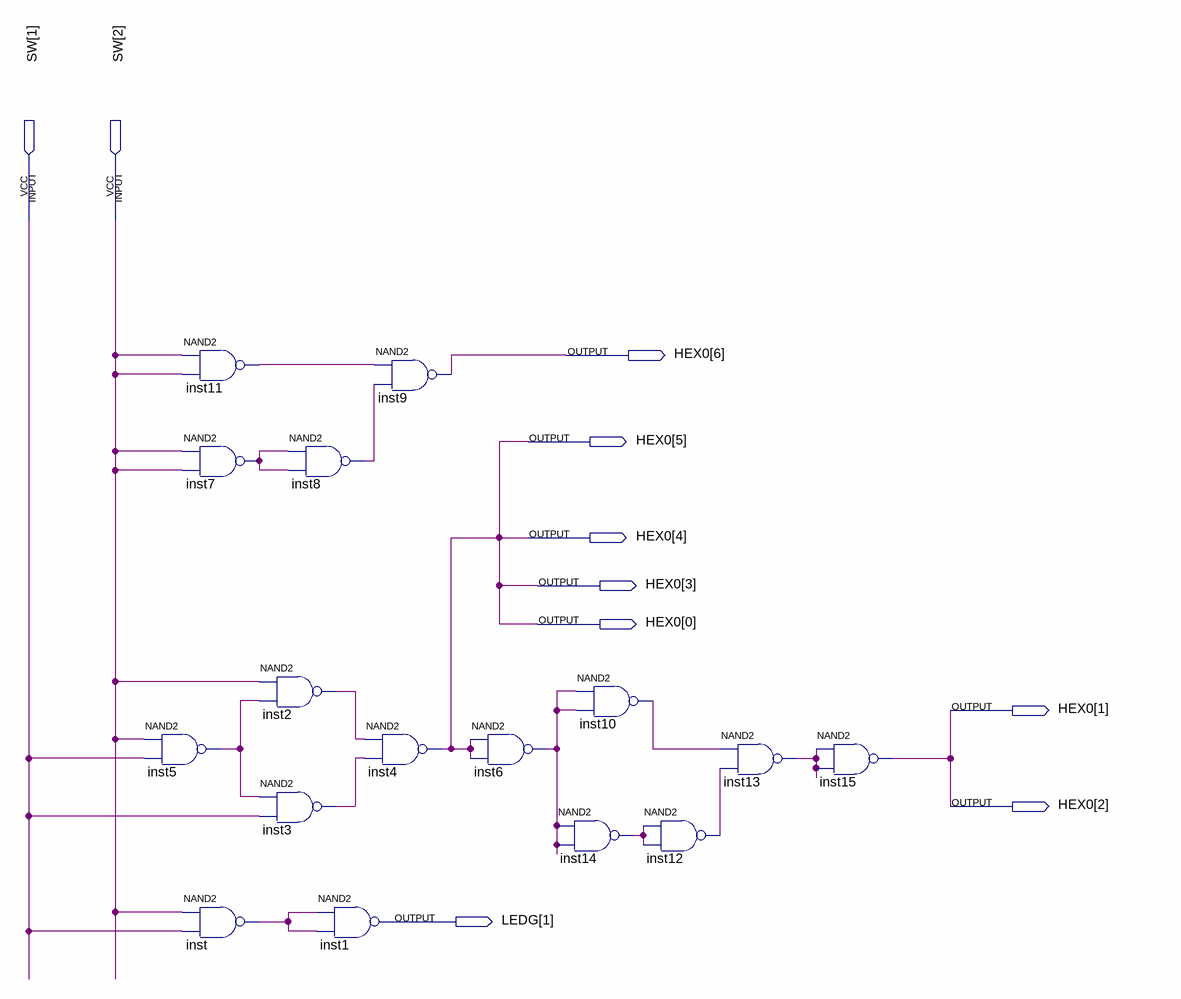
[diagram p0: schematic sheet]
// Quartus schematic Etapa2.bdf as structural Verilog: 16 symbols, 10 pins
module Etapa2 (
  input  [2:1] SW,
  output [6:0] HEX0,
  output [1:1] LEDG
);

  wire inst2_out, inst3_out, inst5_out, inst6_out, inst7_out, inst8_out, inst10_out, inst11_out, inst12_out,
       inst13_out, inst14_out, inst_out;

  nand inst5 (inst5_out, SW[2], SW[1]);
  nand inst11 (inst11_out, SW[2], SW[2]);
  nand inst7 (inst7_out, SW[2], SW[2]);
  nand inst (inst_out, SW[2], SW[1]);
  nand inst8 (inst8_out, inst7_out, inst7_out);
  nand inst2 (inst2_out, SW[2], inst5_out);
  nand inst3 (inst3_out, inst5_out, SW[1]);
  nand inst9 (HEX0[6], inst11_out, inst8_out);
  nand inst4 (HEX0[5], inst2_out, inst3_out);
  nand inst1 (LEDG[1], inst_out, inst_out);
  nand inst6 (inst6_out, HEX0[5], HEX0[5]);
  nand inst10 (inst10_out, inst6_out, inst6_out);
  nand inst14 (inst14_out, inst6_out, inst6_out);
  nand inst12 (inst12_out, inst14_out, inst14_out);
  nand inst13 (inst13_out, inst10_out, inst12_out);
  nand inst15 (HEX0[2], inst13_out, inst13_out);

  assign {HEX0[4:3], HEX0[1:0]} = {{2{HEX0[5]}}, HEX0[2], HEX0[5]};
endmodule
